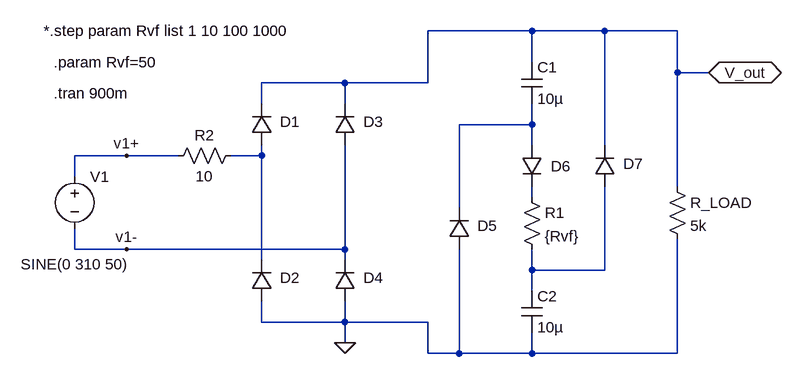
[diagram p0: schematic Valley-Fill.asc]
Valley-Fill.asc, the LTspice schematic file:
Version 4
SHEET 1 1876 680
WIRE 496 -128 336 -128
WIRE 608 -128 496 -128
WIRE 720 -128 608 -128
WIRE 496 -80 496 -128
WIRE 720 -64 720 -128
WIRE 768 -64 720 -64
WIRE 208 -48 80 -48
WIRE 336 -48 336 -128
WIRE 336 -48 208 -48
WIRE 80 -16 80 -48
WIRE 208 -16 208 -48
WIRE 496 16 496 -16
WIRE 496 16 384 16
WIRE 496 48 496 16
WIRE 608 48 608 -128
WIRE -128 64 -208 64
WIRE -48 64 -128 64
WIRE 80 64 80 48
WIRE 80 64 32 64
WIRE -208 96 -208 64
WIRE 720 112 720 -64
WIRE 496 128 496 112
WIRE 384 144 384 16
WIRE -208 208 -208 176
WIRE -128 208 -208 208
WIRE 208 208 208 48
WIRE 208 208 -128 208
WIRE 80 224 80 64
WIRE 208 224 208 208
WIRE 496 240 496 208
WIRE 608 240 608 112
WIRE 608 240 496 240
WIRE 496 272 496 240
WIRE 80 320 80 288
WIRE 208 320 208 288
WIRE 208 320 80 320
WIRE 336 320 208 320
WIRE 208 352 208 320
WIRE 336 368 336 320
WIRE 384 368 384 208
WIRE 384 368 336 368
WIRE 496 368 496 336
WIRE 496 368 384 368
WIRE 720 368 720 192
WIRE 720 368 496 368
FLAG 208 352 0
FLAG 768 -64 V_out
IOPIN 768 -64 BiDir
FLAG -128 64 v1+
FLAG -128 208 v1-
SYMBOL diode 96 48 R180
WINDOW 0 -43 36 Left 2
WINDOW 3 24 0 Invisible 2
SYMATTR InstName D1
SYMATTR Value DI_S1J
SYMBOL diode 96 288 R180
WINDOW 0 -43 36 Left 2
WINDOW 3 24 0 Invisible 2
SYMATTR InstName D2
SYMATTR Value DI_S1J
SYMBOL diode 224 48 R180
WINDOW 0 -43 36 Left 2
WINDOW 3 24 0 Invisible 2
SYMATTR InstName D3
SYMATTR Value DI_S1J
SYMBOL diode 224 288 R180
WINDOW 0 -43 36 Left 2
WINDOW 3 24 0 Invisible 2
SYMATTR InstName D4
SYMATTR Value DI_S1J
SYMBOL diode 400 208 R180
WINDOW 0 -43 36 Left 2
WINDOW 3 24 0 Invisible 2
SYMATTR InstName D5
SYMATTR Value DI_S1J
SYMBOL diode 480 48 R0
WINDOW 0 45 32 Left 2
WINDOW 3 24 64 Invisible 2
SYMATTR InstName D6
SYMATTR Value DI_S1J
SYMBOL diode 624 112 R180
WINDOW 0 -43 36 Left 2
WINDOW 3 24 0 Invisible 2
SYMATTR InstName D7
SYMATTR Value DI_S1J
SYMBOL cap 480 -80 R0
SYMATTR InstName C1
SYMATTR Value 10µ
SYMBOL cap 480 272 R0
SYMATTR InstName C2
SYMATTR Value 10µ
SYMBOL res 480 112 R0
SYMATTR InstName R1
SYMATTR Value {Rvf}
SYMBOL voltage -208 80 R0
WINDOW 3 -83 151 Left 2
WINDOW 123 0 0 Left 0
WINDOW 39 0 0 Left 0
SYMATTR Value SINE(0 310 50)
SYMATTR InstName V1
SYMBOL res 704 96 R0
SYMATTR InstName R_LOAD
SYMATTR Value 5k
SYMBOL res 48 48 R90
WINDOW 0 0 56 VBottom 2
WINDOW 3 32 56 VTop 2
SYMATTR InstName R2
SYMATTR Value 10
TEXT -240 -32 Left 2 !.tran 900m
TEXT -256 -128 Left 2 !*.step param Rvf list 1 10 100 1000
TEXT -240 -80 Left 2 !.param Rvf=50

The netlist it stands for:
* Valley-Fill.asc
D1 N002 V_out DI_S1J
D2 0 N002 DI_S1J
D3 v1- V_out DI_S1J
D4 0 v1- DI_S1J
D5 0 N001 DI_S1J
D6 N001 N003 DI_S1J
D7 N004 V_out DI_S1J
C1 V_out N001 10µ
C2 N004 0 10µ
R1 N003 N004 {Rvf}
V1 v1+ v1- SINE(0 310 50)
R_LOAD V_out 0 5k
R2 N002 v1+ 10
.model D D
.lib standard.dio
.tran 900m
*.step param Rvf list 1 10 100 1000
.param Rvf=50
.backanno
.end